# Altium schematic sheet Power Harvesting.SchDoc
size A4; SheetNumber: 1; SheetTotal: 3
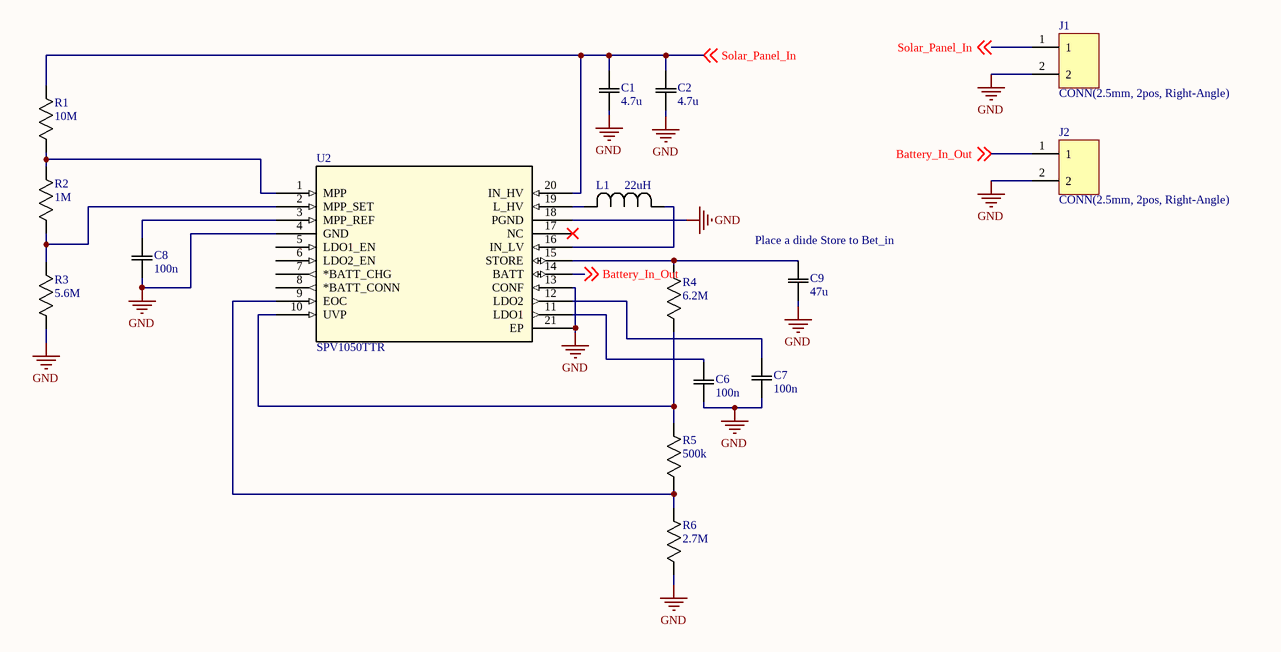
[diagram p0: Power Harvesting.SchDoc]

## Parts
C1  4.7u  [CAPC220145_100N_KEM]
C2  4.7u  [CAPC220145_100N_KEM]
C6  100n  [YAG_CC0603_YAG]
C7  100n  [YAG_CC0603_YAG]
C8  100n  [YAG_CC0603_YAG]
C9  47u  [CAPC220145_100N_KEM]
J1  CONN(2.5mm, 2pos, Right-Angle)  [CONN_S2B-PH-K-S_JST]
J2  CONN(2.5mm, 2pos, Right-Angle)  [CONN_S2B-PH-K-S_JST]
L1  22uH  [IND_LPS4018-103MLB_COC]
R1  10M  [RES_CRCW_0805_VIS]
R2  1M  [RES_CRCW_0805_VIS]
R3  5.6M  [RES_CRCW_0805_VIS]
R4  6.2M  [RES_CRCW_0805_VIS]
R5  500k  [RES_CRCW_0805_VIS]
R6  2.7M  [RES_CRCW_0805_VIS]
U2  SPV1050TTR  [VFQFPN20_3X3_STM]

## Nets
GND: C1.2 C2.2 C6.1 C7.1 C8.1 C9.2 J1.2 J2.2 R3.1 R6.1 U2.4(GND) U2.13(CONF) U2.18(PGND) U2.21(EP)
Battery_In_Out: J2.1 U2.14(BATT) ; off-sheet Battery_In_Out
Solar_Panel_In: C1.1 C2.1 J1.1 R1.2 U2.20(IN_HV) ; off-sheet Solar_Panel_In
NetC6_2: C6.2 U2.11(LDO1)
NetC7_2: C7.2 U2.12(LDO2)
NetC8_2: C8.2 U2.3(MPP_REF)
NetC9_1: C9.1 R4.2 U2.15(STORE)
NetL1_1: L1.1 U2.16(IN_LV)
NetL1_2: L1.2 U2.19(L_HV)
NetR1_1: R1.1 R2.2 U2.1(MPP)
NetR2_1: R2.1 R3.2 U2.2(MPP_SET)
NetR4_1: R4.1 R5.2 U2.10(UVP)
NetR5_1: R5.1 R6.2 U2.9(EOC)

Not connected (* = marked no-connect by the designer): U2 5(LDO1_EN) 6(LDO2_EN) 7(*BATT_CHG) 8(*BATT_CONN) 17(NC)*

## Notes on the sheet
- (near C9) Place a diıde Store to Bet_in

## Library data of the parts
C1 C2 C9 = C0805C105Z4VACTU: SMD-805; Mfr_Name: Kemet; Type: DEV; Copyright: Copyright (C) 2023 Ultra Librarian. All rights reserved.; Manufacturer_Part_Number: C0805C105Z4VACTU; RefDes: RefDes
C6-C8 = CC0603KRX7R8BB104: No Description Available; Mfr_Name: Yageo; Type: DEV; Copyright: Copyright (C) 2024 Ultra Librarian. All rights reserved.; Manufacturer_Part_Number: CC0603KRX7R8BB104; RefDes: RefDes
J1 J2 = CONN(2.5mm, 2pos, Right-Angle): No Description Available; Mfr_Name: JST; RefDes: RefDes; Type: Type
L1 = LPS4018-103MLB: No Description Available; Mfr_Name: Coilcraft; Type: DEV; Copyright: Copyright (C) 2024 Ultra Librarian. All rights reserved.; Manufacturer_Part_Number: LPS4018-103MLB; RefDes: RefDes
R1 = CRCW0805100KJNEAC: 10K; Mfr_Name: Vishay; Copyright: Copyright (C) 2023 Ultra Librarian. All rights reserved.; Manufacturer_Part_Number: CRCW0805100KJNEAC; RefDes: RefDes; Type: DEV
R2-R6 = CRCW0805100KJNEAC: No Description Available; Mfr_Name: Vishay; Copyright: Copyright (C) 2023 Ultra Librarian. All rights reserved.; Manufacturer_Part_Number: CRCW0805100KJNEAC; RefDes: RefDes; Type: DEV
U2 = SPV1050TTR: No Description Available; Mfr_Name: STMicroelectronics; Copyright: Copyright (C) 2024 Ultra Librarian. All rights reserved.; Manufacturer_Part_Number: SPV1050TTR; RefDes: RefDes; Type: DEV